# Altium schematic sheet ESP32+Board.schdoc
size 396 x 307 mm
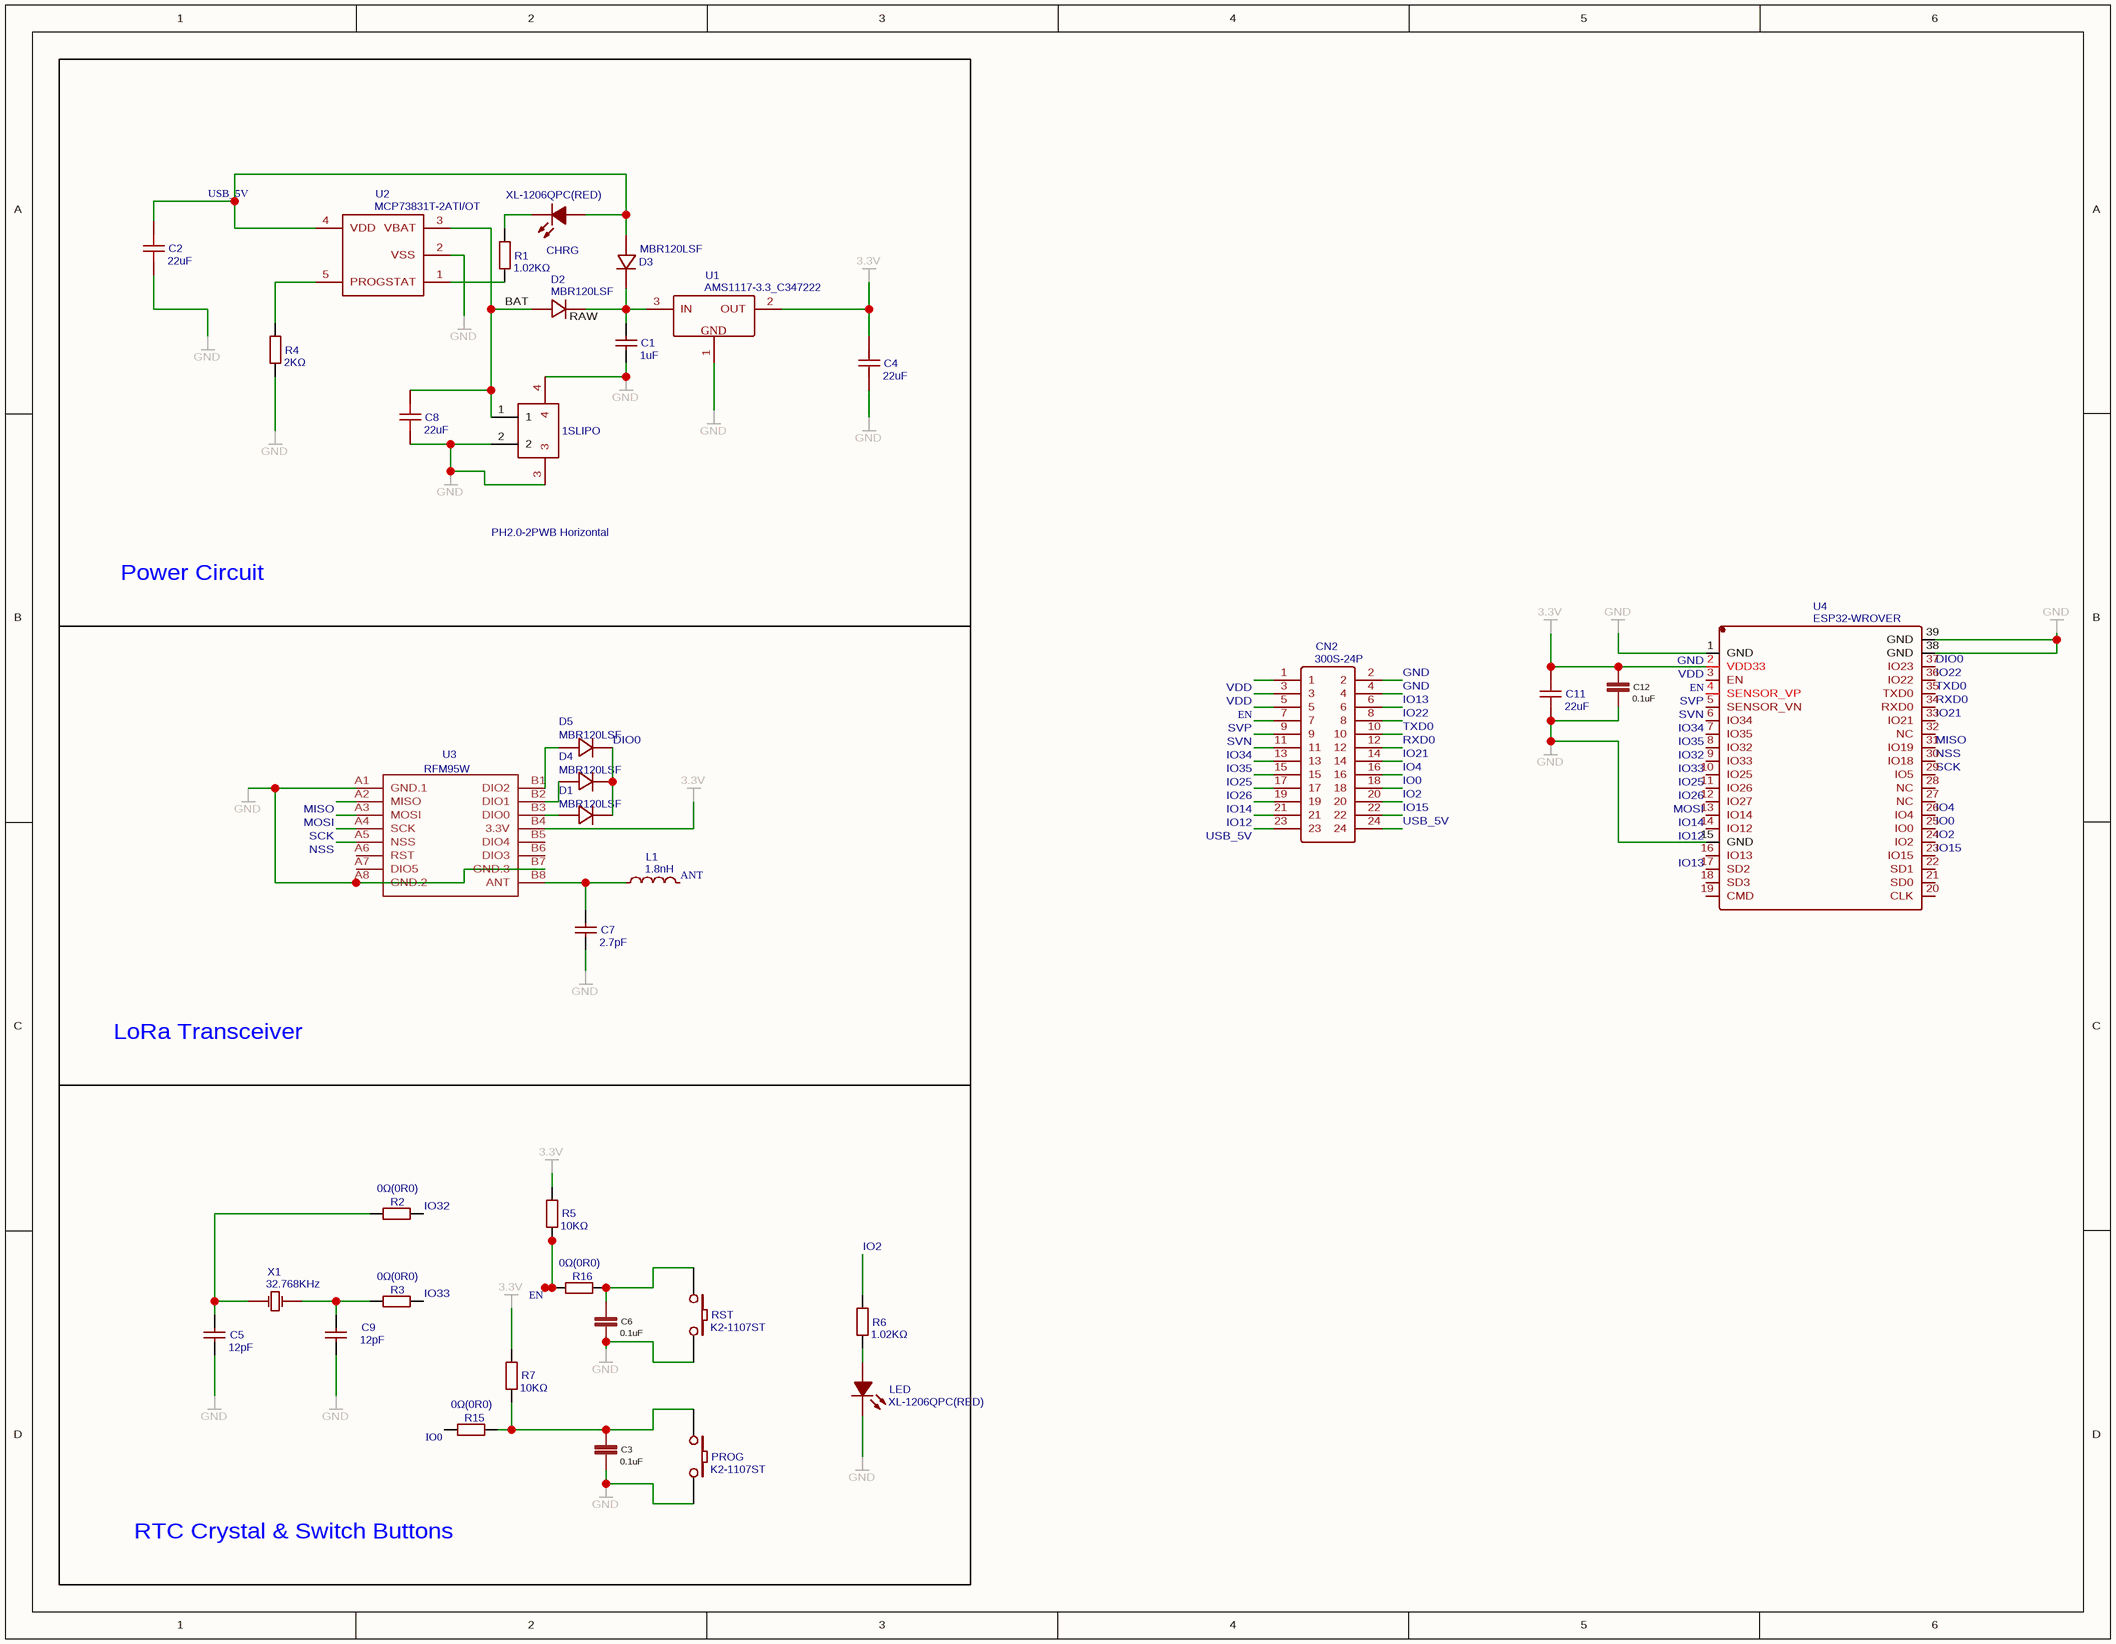
[diagram p0: ESP32+Board.schdoc]

## Parts
1SLIPO  PH2.0-2PWB Horizontal  [PH2.0-2PWB-HORIZONTAL]
C1  1uF  [0805]
C2  22uF  [0805]
C3  0.1uF  [0603-CAP]
C4  22uF  [0805]
C5  12pF  [0603]
C6  0.1uF  [0603-CAP]
C7  2.7pF  [0603]
C8  22uF  [0805]
C9  12pF  [0603]
C11  22uF  [0805]
C12  0.1uF  [0603-CAP]
CHRG  XL-1206QPC(RED)  [1206]
CN2  300S-24P  [300S-24P]
D1  MBR120LSF  [SOD-123FL]
D2  MBR120LSF  [SOD-123FL]
D3  MBR120LSF  [SOD-123FL]
D4  MBR120LSF  [SOD-123FL]
D5  MBR120LSF  [SOD-123FL]
L1  1.8nH  [0603]
LED  XL-1206QPC(RED)  [1206]
PROG  K2-1107ST  [SMD-6.1X3.6]
R1  1.02KΩ  [0805]
R2  0Ω(0R0)  [0603]
R3  0Ω(0R0)  [0603]
R4  2KΩ  [0805]
R5  10KΩ  [0805]
R6  1.02KΩ  [0805]
R7  10KΩ  [0805]
R15  0Ω(0R0)  [0603]
R16  0Ω(0R0)  [0603]
RST  K2-1107ST  [SMD-6.1X3.6]
U1  AMS1117-3.3_C347222  [SOT-223]
U2  MCP73831T-2ATI/OT  [SOT-23-5]
U3  RFM95W  [WIRELESS-LORA-RFM95WSMD]
U4  ESP32-WROVER  [ESP32-WROVER]
X1  32.768KHz  [SMD-3215_2P]

## Blocks framed on the sheet
Power Circuit: 1SLIPO C1 C2 C4 C8 CHRG D2 D3 R1 R4 U1 U2
LoRa Transceiver: C7 D1 D4 D5 L1 U3
RTC Crystal & Switch Buttons: C3 C5 C6 C9 LED PROG R2 R3 R5-R7 R15 R16 RST X1

## Nets
GND: 1SLIPO.2 1SLIPO.3 1SLIPO.4 C1.1 C2.1 C3.2 C4.1 C5.1 C6.2 C7.1 C8.1 C9.1 C11.1 C12.2 CN2.2 CN2.4 LED.1(K) PROG.2 R4.1 RST.2 U1.1(ADJ) U2.2(VSS) U3.A1(GND.1) U3.A8(GND.2) U3.B7(GND.3) U4.1(GND) U4.15(GND) U4.38(GND) U4.39(GND)
VDD: C4.2 C11.2 C12.1 CN2.1 CN2.3 R5.2 R7.2 U1.2(OUT) U3.B4(3.3V) U4.2(VDD33)  [also labelled 3.3V]
ANT: L1.2
BAT: 1SLIPO.1 C8.2 D2.2(A) U2.3(VBAT)
DIO0: D1.1(C) D4.1(C) D5.1(C) U4.37(IO23)
EN: CN2.5 R5.1 R16.1 U4.3(EN)
IO0: CN2.18 R15.1 U4.25(IO0)
IO2: CN2.20 R6.2 U4.24(IO2)
IO4: CN2.16 U4.26(IO4)
IO12: CN2.21 U4.14(IO12)
IO13: CN2.6 U4.16(IO13)
IO14: CN2.19 U4.13(IO14)
IO15: CN2.22 U4.23(IO15)
IO21: CN2.14 U4.33(IO21)
IO22: CN2.8 U4.36(IO22)
IO25: CN2.15 U4.10(IO25)
IO26: CN2.17 U4.11(IO26)
IO32: R2.2 U4.8(IO32)
IO33: R3.2 U4.9(IO33)
IO34: CN2.11 U4.6(IO34)
IO35: CN2.13 U4.7(IO35)
MISO: U3.A2(MISO) U4.31(IO19)
MOSI: U3.A3(MOSI) U4.12(IO27)
NSS: U3.A5(NSS) U4.30(IO18)
RAW: C1.2 D2.1(C) D3.1(C) U1.3(IN)
RXD0: CN2.12 U4.34(RXD0)
SCK: U3.A4(SCK) U4.29(IO5)
SVN: CN2.9 U4.5(SENSOR_VN)
SVP: CN2.7 U4.4(SENSOR_VP)
TXD0: CN2.10 U4.35(TXD0)
USB_5V: C2.2 CHRG.2(A) CN2.23 CN2.24 D3.2(A) U2.4(VDD)
NetC3_1: C3.1 PROG.1 R7.1 R15.2
NetC5_2: C5.2 R2.1 X1.2(OSC2)
NetC6_1: C6.1 R16.2 RST.1
NetC7_2: C7.2 L1.1 U3.B8(ANT)
NetC9_2: C9.2 R3.1 X1.1(OSC1)
NetCHRG_1: CHRG.1(K) R1.2
NetD1_2: D1.2(A) U3.B3(DIO0)
NetD4_2: D4.2(A) U3.B2(DIO1)
NetD5_2: D5.2(A) U3.B1(DIO2)
NetLED_2: LED.2(A) R6.1
NetR1_1: R1.1 U2.1(STAT)
NetR4_2: R4.2 U2.5(PROG)

Not connected (* = marked no-connect by the designer): U3 A6(RST) A7(DIO5) B5(DIO4) B6(DIO3); U4 17(SD2) 18(SD3) 19(CMD) 20(CLK) 21(SD0) 22(SD1) 27(NC) 28(NC) 32(NC)

## Notes on the sheet
- (in symbol AMS1117-3.3_C347222) GND

## Library data of the parts
1SLIPO = PH2.0-2PWB Horizontal: BOM_Manufacturer: BOOMELE; BOM_Supplier: LCSC; BOM_Manufacturer Part: PH2.0-2PWB Horizontal; image: //image.lceda.cn/szlcsc/C47647.jpg; BOM_Supplier Part: C47647; spicePre: P
C1 = 1uF: BOM_Manufacturer: FH; BOM_Manufacturer Part: 0805B105K500NT; Voltage: 50V; Tolerance: ±10%; Value: 1uF; BOM_Supplier: LCSC; spicePre: C; BOM_Supplier Part: C29822
C2 C4 C8 C11 = 22uF: BOM_Manufacturer: Samsung Electro-Mechanics; BOM_Manufacturer Part: CL21X226MRQNNNE; nameAlias: Capacitance; Contributor: LCSC; BOM_Supplier: LCSC; BOM_Supplier Part: C307563; spicePre: C; spiceSymbolName: CL21X226MRQNNNE
C5 C9 = 12pF: BOM_Manufacturer: MuRata; BOM_Manufacturer Part: GCM1882C1H120FA01D; nameAlias: Capacitance; BOM_Supplier: LCSC; BOM_Supplier Part: C126539; spicePre: C; spiceSymbolName: GCM1882C1H120FA01D
C7 = 2.7pF: BOM_Manufacturer Part: CL10C2R7CB8NNNC; BOM_Manufacturer: SAMSUNG; nameAlias: Capacitance; Contributor: LCSC; BOM_Supplier: LCSC; BOM_LCSC Assembly: Yes; BOM_Supplier Part: C16149; spicePre: C; spiceSymbolName: CL10C2R7CB8NNNC
CHRG LED = XL-1206QPC(RED): BOM_Manufacturer: LCSC; BOM_Supplier: LCSC; BOM_Manufacturer Part: XL-1206QPC; spicePre: L; BOM_Supplier Part: C10781
CN2 = 300S-24P: BOM_Manufacturer: Shenzhen Cankemeng; Contributor: LCSC; BOM_Supplier: LCSC; BOM_Supplier Part: C132440; BOM_Manufacturer Part: -; spicePre: C
D1-D5 = MBR120LSF: BOM_Manufacturer: SK; Contributor: LCSC; BOM_Supplier: LCSC; BOM_Manufacturer Part: MBR120LSF; BOM_Supplier Part: C130880; spicePre: D
L1 = 1.8nH: BOM_Manufacturer: FH; BOM_Manufacturer Part: VHF160808H1N8ST; nameAlias: Inductance; Contributor: LCSC; BOM_Supplier: LCSC; BOM_Supplier Part: C1026; spicePre: L; spiceSymbolName: VHF160808H1N8ST
PROG RST = K2-1107ST: BOM_Manufacturer: HRO; Contributor: LCSC; BOM_Supplier: LCSC; BOM_Manufacturer Part: K2-1107ST; BOM_Supplier Part: C118141; spicePre: S
R1 R6 = 1.02KΩ: BOM_Manufacturer: UniOhm; BOM_Manufacturer Part: 0805W8F1021T5E; Power: 1/8W; Tolerance: ±1%; Value: 1.02KΩ; BOM_Supplier: LCSC; spicePre: R; BOM_Supplier Part: C17369
R2 R3 R15 R16 = 0Ω(0R0): BOM_Manufacturer: LIZ; BOM_Manufacturer Part: CR0603FA0000G; nameAlias: Value; BOM_Supplier: LCSC; BOM_Supplier Part: C100699; spicePre: R; spiceSymbolName: CR0603FA0000G
R4 = 2KΩ: BOM_Manufacturer: UniOhm; BOM_Manufacturer Part: 0805W8J0202T5E; Power: 1/8W; Tolerance: ±5%; Value: 2KΩ; BOM_Supplier: LCSC; spicePre: R; BOM_Supplier Part: C1359
R5 R7 = 10KΩ: BOM_Manufacturer: UniOhm; BOM_Manufacturer Part: 0805W8J0103T5E; nameAlias: Value; BOM_Supplier: LCSC; BOM_Supplier Part: C25612; spicePre: R; spiceSymbolName: 0805W8J0103T5E
U1 = AMS1117-3.3_C347222: BOM_Manufacturer: Youtai Semiconductor Co., Ltd.; Contributor: LCSC; BOM_Supplier: LCSC; BOM_Supplier Part: C347222; BOM_Manufacturer Part: AMS1117-3.3; spicePre: U
U2 = MCP73831T-2ATI/OT: BOM_Manufacturer: MICROCHIP; Contributor: LCSC; BOM_Supplier: LCSC; BOM_Manufacturer Part: MCP73831T-2ATI/OT; image: //image.lceda.cn/szlcsc/C14879.jpg; BOM_Supplier Part: C14879; spicePre: U
U3 = RFM95W: BOM_Manufacturer Part: RFM95W-868S2; catid: 20; description: 868915 MHz LoRa Radio Transceiver Module based on SX1276 chip; spicePre: U; BOM_Supplier: RS-Online; BOM_Supplier Part: 125-1259
U4 = ESP32-WROVER: BOM_Manufacturer: Espressif Systems; Contributor: LCSC; BOM_Supplier: LCSC; BOM_Supplier Part: C129145; BOM_Manufacturer Part: ESP32-WROVER; spicePre: U
X1 = 32.768KHz: BOM_Manufacturer: YXC; BOM_Manufacturer Part: YST310S32.768KHz12.5pF10ppm; nameAlias: Frequency; BOM_Supplier: LCSC; BOM_Supplier Part: C94279; spicePre: X; spiceSymbolName: YST310S32.768KHz12.5pF10ppm